# EAGLE design DC28_Jack-Attack_Badge-4 (EAGLE 9.5.2)
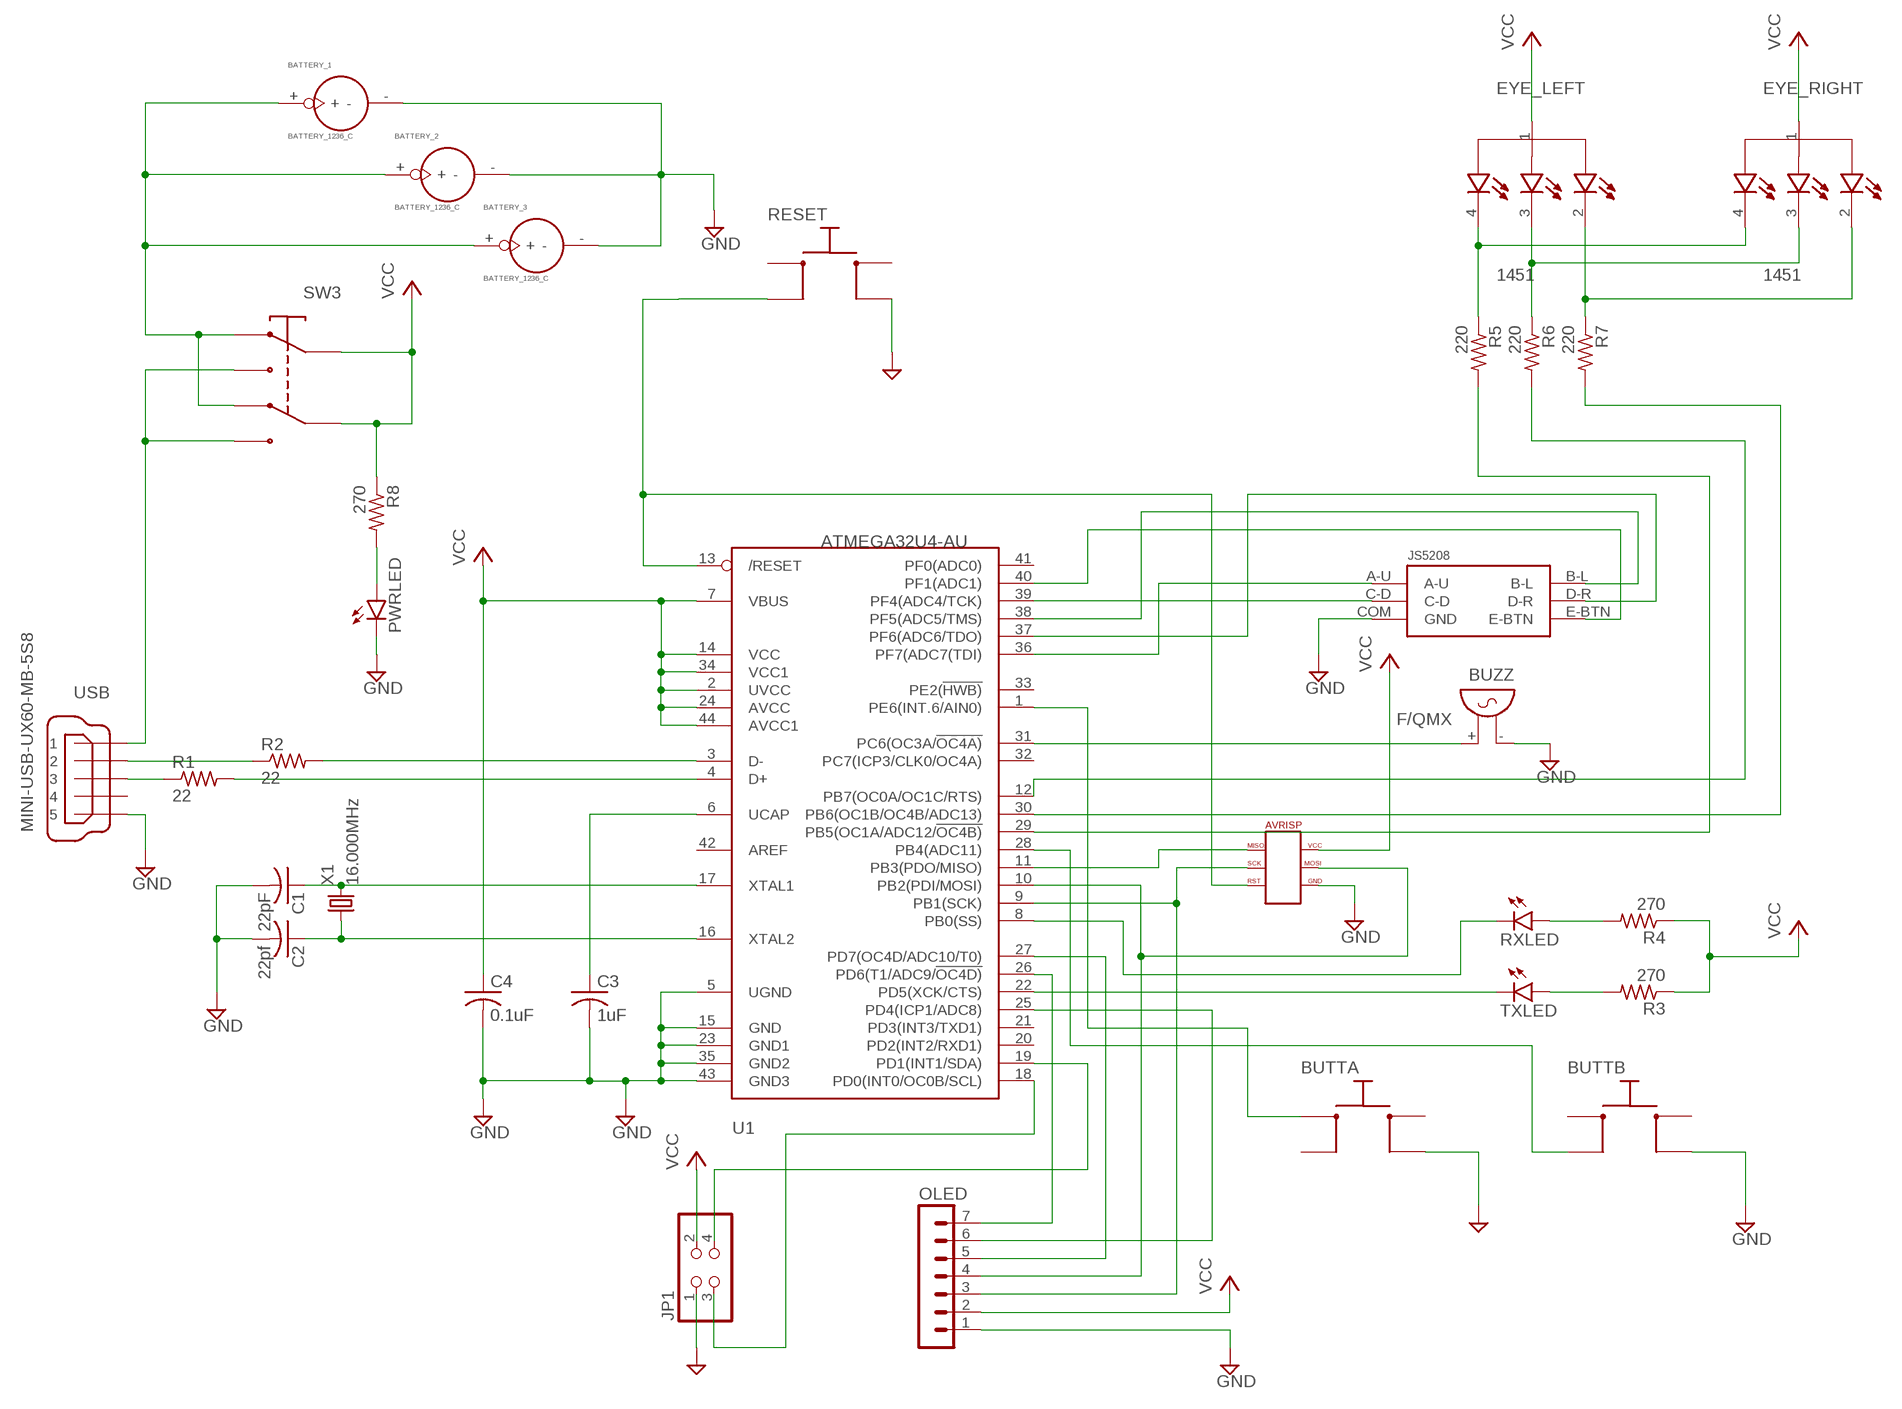
[diagram p0: schematic, sheet 1]

## Parts
BATTERY_1  BATTERY_1236_C  [BATTERY_1236_C]
BATTERY_2  BATTERY_1236_C  [BATTERY_1236_C]
BATTERY_3  BATTERY_1236_C  [BATTERY_1236_C]
BUTTA  PTS645  [PTS645_SMD]
BUTTB  PTS645  [PTS645_SMD]
BUZZ  F/QMX  [F/QMX]
C1  22pF  C-USC0805  [C0805]
C2  22pf  C-USC0805  [C0805]
C3  1uF  C-USC0805  [C0805]
C4  0.1uF  C-USC0805  [C0805]
EYE_LEFT  1451  [LED_1451]
EYE_RIGHT  1451  [LED_1451]
JP1  PINHD-2X2  [2X02]
OLED  MA07-1  [MA07-1]
PWRLED  LEDCHIP-LED0805  [CHIP-LED0805]
R1  22  R-US_R0805  [R0805]
R2  22  R-US_R0805  [R0805]
R3  270  R-US_R0805  [R0805]
R4  270  R-US_R0805  [R0805]
R5  220  R-US_R0805  [R0805]
R6  220  R-US_R0805  [R0805]
R7  220  R-US_R0805  [R0805]
R8  270  R-US_R0805  [R0805]
RESET  PTS645  [PTS645_SMD]
RXLED  LEDCHIP-LED0805  [CHIP-LED0805]
SW3  JS202011AQN  [JS202011AQN]
TXLED  LEDCHIP-LED0805  [CHIP-LED0805]
U1  ATMEGA32U4-AU  [TQFP44]
U$1  AVRISP_POGO  [AVRISP_POGO]
U$2  JS5208  [JS5208_PKG]
USB  MINI-USB-UX60-MB-5S8  [UX60-MB-5S8]
X1  16.000MHz  CSM-7X-DU  [CSM-7X-DU]

## Nets
BATT1: BATTERY_1.+ BATTERY_2.+ BATTERY_3.+ SW3.P$1 SW3.P$4
GND: BATTERY_1.- BATTERY_2.- BATTERY_3.- BUTTA.P$4 BUTTB.P$4 BUZZ.- C1.2 C2.2 C3.2 C4.2 JP1.1 OLED.1 PWRLED.C RESET.P$4 U1.5(UGND) U1.15(GND) U1.23(GND1) U1.35(GND2) U1.43(GND3) U$1.P$6 U$1.P$6B U$2.COM(GND) USB.5
N$1: R1.1 USB.3
N$2: R2.2 U1.3(D-)
N$3: R2.1 USB.2
N$4: R1.2 U1.4(D+)
N$5: C3.1 U1.6(UCAP)
N$6: BUTTA.P$1 U1.1(PE6(INT.6/AIN0))
N$7: C2.1 U1.16(XTAL2) X1.1
N$8: C1.1 U1.17(XTAL1) X1.2
N$9: U1.36(PF7(ADC7(TDI)) U$2.A-U
N$10: U1.11(PB3(PDO/MISO)) U$1.P$1 U$1.P$1B
N$11: OLED.3 U1.9(PB1(SCK)) U$1.P$3 U$1.P$3B
N$12: OLED.4 U1.10(PB2(PDI/MOSI)) U$1.P$4 U$1.P$4B
N$13: U1.37(PF6(ADC6/TDO)) U$2.D-R
N$14: BUTTB.P$2 U1.28(PB4(ADC11))
N$15: RESET.P$2 U1.13(/RESET) U$1.P$5 U$1.P$5B
N$16: BUZZ.+ U1.31(PC6(OC3A/!OC4A))
N$17: TXLED.C U1.22(PD5(XCK/CTS))
N$18: U1.38(PF5(ADC5/TMS)) U$2.B-L
N$19: U1.39(PF4(ADC4/TCK)) U$2.C-D
N$20: R3.2 TXLED.A
N$21: RXLED.C U1.8(PB0(SS))
N$22: R4.2 RXLED.A
N$23: U1.40(PF1(ADC1)) U$2.E-BTN
N$24: PWRLED.A R8.2
N$25: OLED.5 U1.27(PD7(OC4D/ADC10/T0))
N$26: OLED.6 U1.25(PD4(ICP1/ADC8))
N$27: JP1.4 U1.19(PD1(INT1/SDA))
N$28: JP1.3 U1.18(PD0(INT0/OC0B/SCL))
N$29: OLED.7 U1.26(PD6(T1/ADC9/!OC4D))
N$30: R7.2 U1.30(PB6(OC1B/OC4B/ADC13))
N$31: R5.2 U1.29(PB5(OC1A/ADC12/!OC4B))
N$33: EYE_LEFT.4 EYE_RIGHT.4 R5.1
N$34: R6.2 U1.12(PB7(OC0A/OC1C/RTS))
N$36: EYE_LEFT.3 EYE_RIGHT.3 R6.1
N$37: EYE_LEFT.2 EYE_RIGHT.2 R7.1
USB+5V: SW3.P$3 SW3.P$6 USB.1
VCC: C4.1 EYE_LEFT.1 EYE_RIGHT.1 JP1.2 OLED.2 R3.1 R4.1 R8.1 SW3.P$2 SW3.P$5 U1.2(UVCC) U1.7(VBUS) U1.14(VCC) U1.24(AVCC) U1.34(VCC1) U1.44(AVCC1) U$1.P$2 U$1.P$2B
Unconnected: BUTTA.P$2 BUTTA.P$3 BUTTB.P$1 BUTTB.P$3 RESET.P$1 RESET.P$3 U1.20(PD2(INT2/RXD1)) U1.21(PD3(INT3/TXD1)) U1.32(PC7(ICP3/CLK0/OC4A)) U1.33(PE2(!HWB)) U1.41(PF0(ADC0)) U1.42(AREF) USB.4

## Library data of the parts
BATTERY_1-BATTERY_3 = Itead_BP_110825:BATTERY_1236_C: SOC004
BUTTA BUTTB RESET = macetech:PTS645
BUZZ = buzzer:F/QMX: BUZZER Source: Buerklin; OC_FARNELL: unknown; OC_NEWARK: unknown
C1-C4 = rcl:C-US: CAPACITOR, American symbol
EYE_LEFT EYE_RIGHT = 1451:1451: Diffused 'Piranha' Super-flux RGB (tri-color) LED (10 pack); AVAILABILITY: Unavailable; DESCRIPTION: Diffused 'Piranha' Super-flux RGB _tri-color_ LED _10 pack_; MF: Adafruit Industries; MP: 1451; PACKAGE: DIP-4 Adafruit Industries; PRICE: None
JP1 = pinhead:PINHD-2X2: PIN HEADER
OLED = con-lstb:MA07-1: PIN HEADER; OC_FARNELL: unknown; OC_NEWARK: unknown
PWRLED RXLED TXLED = led:LED: LED OSRAM: - CHIPLED LG R971, LG N971, LY N971, LG Q971, LY Q971, LO R971, LY R971 LH N974, LH R974 LS Q976, LO Q976, LY Q976 LO Q996 - Hyper CHIPLED LW Q18S LB Q993, LB Q99A, LB R99A - SideLED LS A670, LO A670, LY A670, LG A670, LP A670 LB A673, LV A673, LT A673, LW A673 LH A674 LY A675 LS A676, LA A676, LO A676, LY A676, LW A676 LS A679, LY A679, LG A679 - Hyper Micro SIDELED® LS Y876, LA Y876, LO Y876, LY Y876 LT Y87S - SmartLED LW L88C, LW L88S LB L89C, LB L89S, LG L890 LS L89K, LO L89K, LY L89K LS L896, LA L896, LO L896, LY L896 - TOPLED LS T670, LO T670, LY T670, LG T670, LP T670 LSG T670, LSP T670, LSY T670, LOP T670, LYG T670 LG T671, LOG T671, LSG T671 LB T673, LV T673, LT T673, LW T673 LH T674 LS T676, LA T676, LO T676, LY T676, LB T676, LH T676, LSB T676, LW T676 LB T67C, LV T67C, LT T67C, LS T67K, LO T67K, LY T67K, LW E67C LS E67B, LA E67B, LO E67B, LY E67B, LB E67C, LV E67C, LT E67C LW T67C LS T679, LY T679, LG T679 LS T770, LO T770, LY T770, LG T770, LP T770 LB T773, LV T773, LT T773, LW T773 LH T774 LS E675, LA E675, LY E675, LS T675 LS T776, LA T776, LO T776, LY T776, LB T776 LHGB T686 LT T68C, LB T68C - Hyper Mini TOPLED® LB M676 - Mini TOPLED Santana® LG M470 LS M47K, LO M47K, LY M47K Source: http://www.osram.convergy.de LUXEON: - LUMILED® LXK2-PW12-R00, LXK2-PW12-S00, LXK2-PW14-U00, LXK2-PW14-V00 LXK2-PM12-R00, LXK2-PM12-S00, LXK2-PM14-U00 LXK2-PE12-Q00, LXK2-PE12-R00, LXK2-PE12-S00, LXK2-PE14-T00, LXK2-PE14-U00 LXK2-PB12-K00, LXK2-PB12-L00, LXK2-PB12-M00, LXK2-PB14-N00, LXK2-PB14-P00, LXK2-PB14-Q00 LXK2-PR12-L00, LXK2-PR12-M00, LXK2-PR14-Q00, LXK2-PR14-R00 LXK2-PD12-Q00, LXK2-PD12-R00, LXK2-PD12-S00 LXK2-PH12-R00, LXK2-PH12-S00 LXK2-PL12-P00, LXK2-PL12-Q00, LXK2-PL12-R00 Source: www.luxeon.com KINGBRIGHT: KA-3528ASYC Source: www.kingbright.com
R1-R8 = rcl:R-US_: RESISTOR, American symbol
SW3 = macetech:JS202011AQN
U1 = adafruit:ATMEGA32U4: http://www.ladyada.net/library/eagle
U$1 = macetech:AVRISP_POGO
U$2 = JS5208:JS5208; AVAILABILITY: Unavailable; DESCRIPTION: JS Series 20 mA Gull Wing Silver Contact Navigation Switch; MF: E-Switch; MP: JS5208; PACKAGE: None; PRICE: None
USB = con-hirose:MINI-USB-: MINI USB Connector Source: http://www.hirose.co.jp/cataloge_hp/e24000019.pdf; OC_FARNELL: unknown; OC_NEWARK: unknown
X1 = crystal:CSM-7X-DU: SMD CRYSTAL Source: www.ecsxtal.com .. Crystal 3.6864MHz CSM_7X_DU.PDF; OC_FARNELL: unknown; OC_NEWARK: unknown

## Board
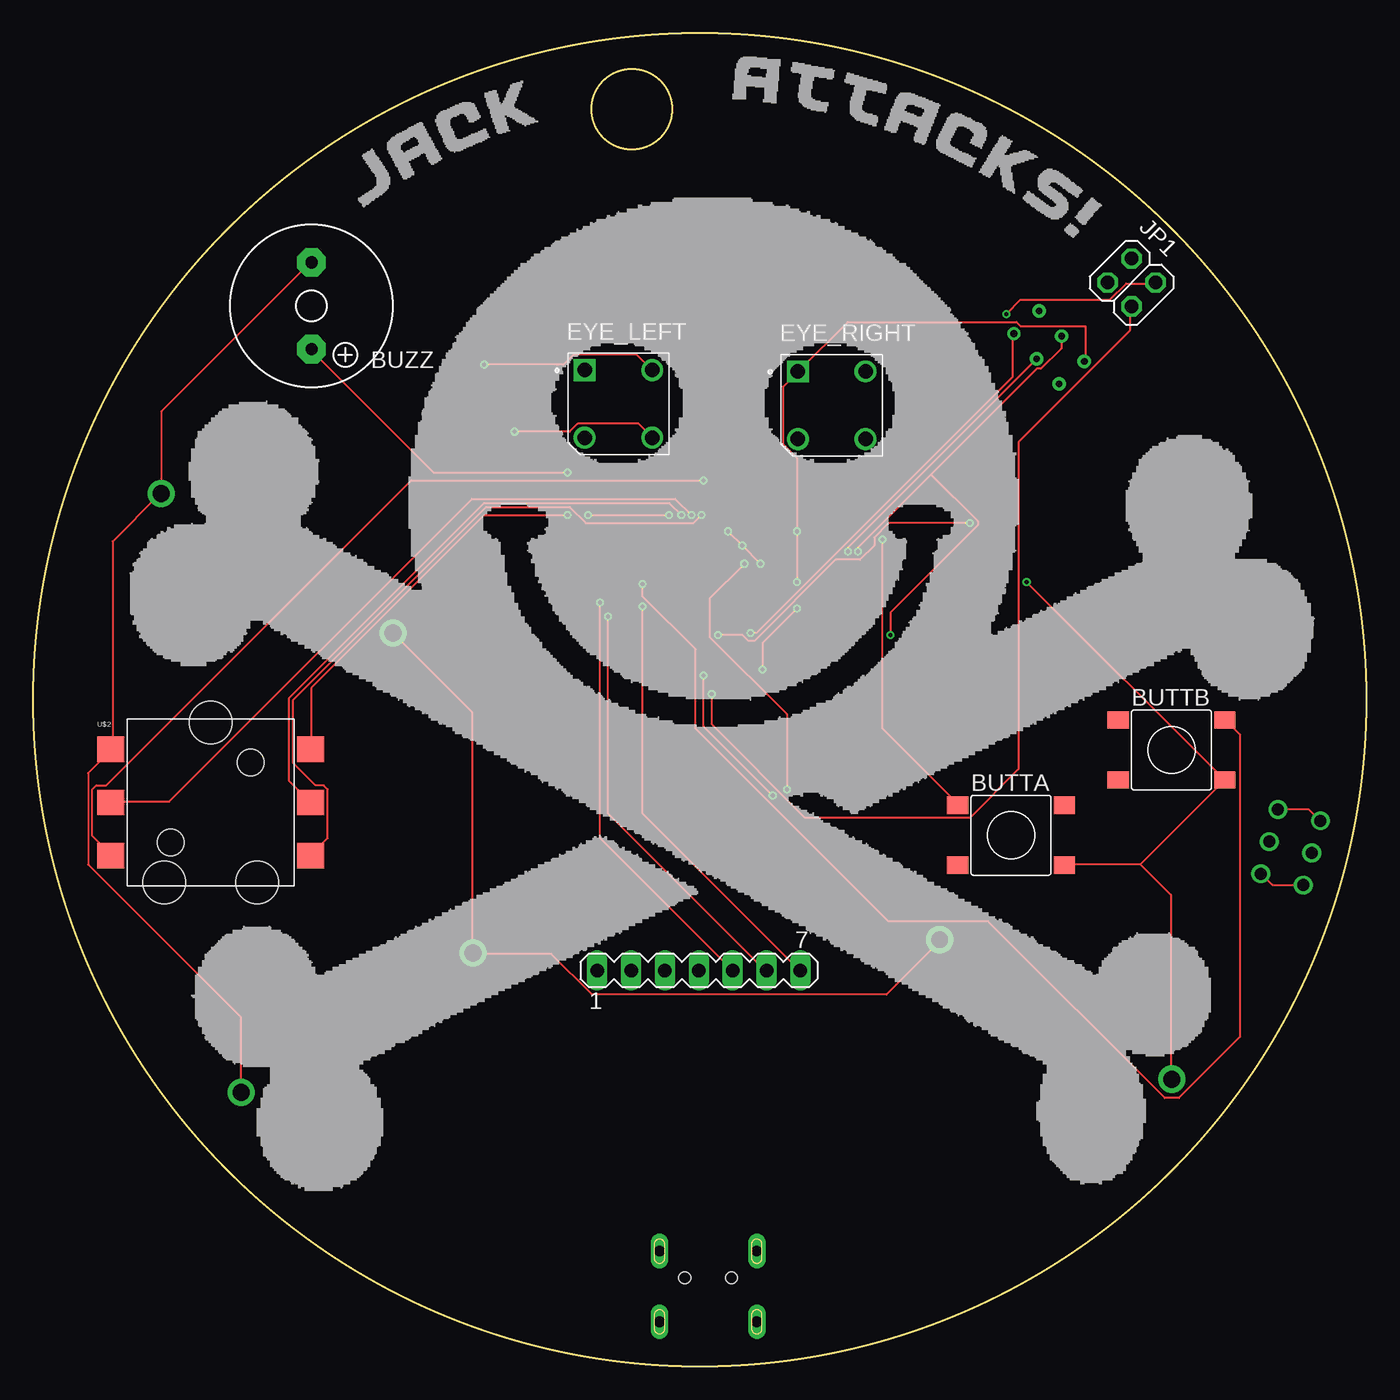
[diagram p1: board, top side]
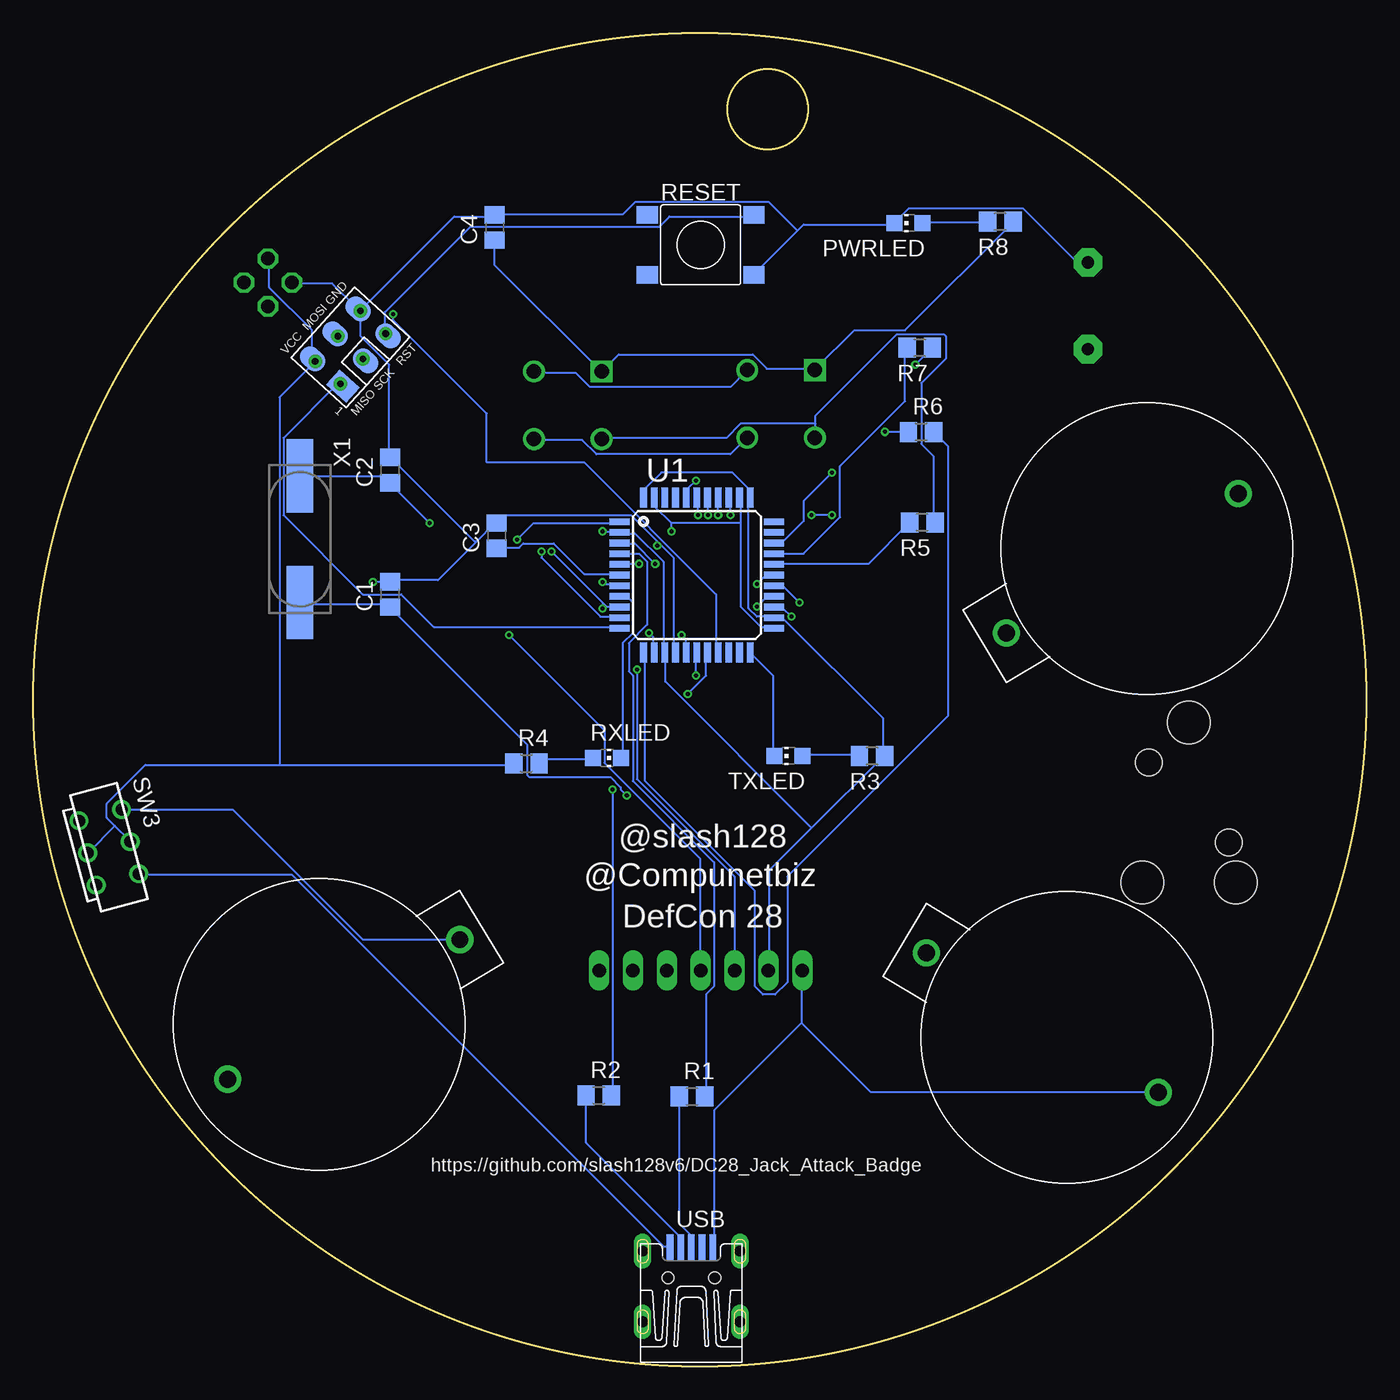
[diagram p2: board, bottom side, seen from below]

Size 100 x 100 mm. Coordinates in mm from the lower left corner, seen from the top.
Outline: circle at 50,50 radius 50
Outline: circle at 44.9,94.3 radius 3
Copper layers (1*16): Top 0.035mm / dielectric 1.5mm / Bottom 0.035mm
Design rules "SeeedStudio_2layer_DRU_no_angle_20140221": minimum track width 6mil, minimum drill 12mil, track to track 6mil, track to pad 6mil, pad to pad 6mil, via to via 6mil, smd to smd 0mil, copper to edge 10mil, drill to drill 10mil, minimum pad ring 10mil, minimum via ring 6mil, stop-mask expansion 2mil, vias tented up to drill 100mil, thermal gap 10mil

### Footprints (pad centres in the part's own frame; a part is rotated, then mirrored left to right if it is on the bottom)
BATTERY_1236_C = drill 1.27 pad 2.032: + 0,0; - 0,20.32
PTS645_SMD = smd 1.6 x 1.3: P$1 -4,2.25; P$2 4,2.25; P$3 -4,-2.25; P$4 4,-2.25
F/QMX = drill 0.914 pad 2.159 octagon: + 3.251,0; - -3.251,0
C0805 = smd 1.3 x 1.5: 1 -0.95,0; 2 0.95,0
LED_1451 = drill 1.09 pad 1.64 square: 1 -2.54,2.54 | drill 1.09 pad 1.64: 2 2.54,2.54; 3 2.54,-2.54; 4 -2.54,-2.54
2X02 = drill 1.016 octagon: 1 -1.27,-1.27; 2 -1.27,1.27; 3 1.27,-1.27; 4 1.27,1.27
MA07-1 = drill 1.016 long: 1 -7.62,0; 2 -5.08,0; 3 -2.54,0; 4 0,0; 5 2.54,0; 6 5.08,0; 7 7.62,0
CHIP-LED0805 = smd 1.2 x 1.2: A 0,-1.05; C 0,1.05
R0805 = smd 1.3 x 1.5: 1 -0.95,0; 2 0.95,0
JS202011AQN = drill 0.9: P$1 -2.5,1.65; P$2 0,1.65; P$3 2.5,1.65; P$4 -2.5,-1.65; P$5 0,-1.65; P$6 2.5,-1.65
TQFP44 = smd 1.5 x 0.5: 1 -5.8,4; 2 -5.8,3.2; 3 -5.8,2.4; 4 -5.8,1.6; 5 -5.8,0.8; 6 -5.8,0; 7 -5.8,-0.8; 8 -5.8,-1.6; 9 -5.8,-2.4; 10 -5.8,-3.2; 11 -5.8,-4; 23 5.8,-4; 24 5.8,-3.2; 25 5.8,-2.4; 26 5.8,-1.6; 27 5.8,-0.8; 28 5.8,0; 29 5.8,0.8; 30 5.8,1.6; 31 5.8,2.4; 32 5.8,3.2; 33 5.8,4 | smd 0.5 x 1.5: 12 -4,-5.8; 13 -3.2,-5.8; 14 -2.4,-5.8; 15 -1.6,-5.8; 16 -0.8,-5.8; 17 0,-5.8; 18 0.8,-5.8; 19 1.6,-5.8; 20 2.4,-5.8; 21 3.2,-5.8; 22 4,-5.8; 34 4,5.8; 35 3.2,5.8; 36 2.4,5.8; 37 1.6,5.8; 38 0.8,5.8; 39 0,5.8; 40 -0.8,5.8; 41 -1.6,5.8; 42 -2.4,5.8; 43 -3.2,5.8; 44 -4,5.8
AVRISP_POGO = smd 2.032 x 1.524: P$1 -1.524,2.54; P$2 1.524,2.54; P$3 -1.524,0; P$4 1.524,0; P$5 -1.524,-2.54; P$6 1.524,-2.54 | drill 0.5: P$1B -1.27,2.54; P$2B 1.27,2.54; P$3B -1.27,0; P$4B 1.27,0; P$5B -1.27,-2.54; P$6B 1.27,-2.54
JS5208_PKG = smd 2 x 1.9: A-U 7.5,4; B-L -7.5,0; C-D 7.5,-4; COM -7.5,4; D-R 7.5,0; E-BTN -7.5,-4 | hole 3.2: -3.5,-6; 3.5,-6; 0,6 | hole 2: -3,-3; 3,3
UX60-MB-5S8 = smd 2 x 0.5: 1 8.65,1.6; 2 8.65,0.8; 3 8.65,0; 4 8.65,-0.8; 5 8.65,-1.6 | drill 0.8 long: M1 3.1,-3.65; M2 3.1,3.65; M3 8.4,3.65; M4 8.4,-3.65 | hole 0.9: 6.4,-1.75; 6.4,1.75
CSM-7X-DU = smd 5.5 x 2: 1 -4.75,0; 2 4.75,0

### Placement (x,y rotation side)
BATTERY_1  68,32 121 bottom
BATTERY_2  33,31 239 bottom
BATTERY_3  27,55 301 bottom
BUTTA  73.35,39.83 0 top
BUTTB  85.39,46.23 0 top
BUZZ  20.87,79.56 270 top
C1  73.23,57.91 90 bottom
C2  73.23,67.23 90 bottom
C3  65.23,62.31 90 bottom
C4  65.39,85.43 90 bottom
EYE_LEFT  43.9,72.2 0 top
EYE_RIGHT  59.9,72.1 0 top
JP1  82.4,81.3 315 top
OLED  49.93,29.69 0 top
PWRLED  34.36,85.77 90 bottom
R1  50.58,20.24 0 bottom
R2  57.58,20.32 0 bottom
R3  37.07,45.77 180 bottom
R4  63.01,45.23 0 bottom
R5  33.3,63.3 180 bottom
R6  33.4,70.1 0 bottom
R7  33.5,76.4 180 bottom
R8  27.45,85.87 180 bottom
RESET  49.93,84.13 0 bottom
RXLED  56.95,45.63 270 bottom
SW3  94.33,38.93 285 bottom
TXLED  43.35,45.8 90 bottom
U1  50.22,59.36 0 bottom
U$1  76.21,76.43 138 bottom
U$2  13.3,42.3 0 top
USB  50.63,0.23 90 bottom
X1  80,62.04 270 bottom

### Tracks (layer width: path | path; a pad name or v marks a point on that pad's centre or on a via)
BATT1
  Top 0.152: BATTERY_3.+ 27.13,54.86 32.92,49.07 32.92,31.09 BATTERY_2.+ 33.07,30.94 38.86,30.94 41.91,27.89 64.01,27.89 67.97,31.85 BATTERY_1.+ | SW3.P$1 93.42,41.76 95.71,41.76 96.47,41 SW3.P$4
  Bottom 0.152: BATTERY_1.+ 68.12,32 75.29,32 85.04,41.76 93.27,41.76 SW3.P$1
GND  (via drill 0.3)
  Top 0.152: 83.06,37.64 77.42,37.64 BUTTA.P$4 | 83.06,37.64 89.31,43.89 BUTTB.P$4 89.31,44.04 v74.52,58.83 | 83.06,37.64 85.34,35.36 85.34,21.64 BATTERY_1.- | v54.56,60.2 v53.19,61.57 v52.12,62.64 | BUZZ.- 20.73,82.75 9.6,71.63 9.6,65.53 BATTERY_3.- 9.45,65.38 5.94,61.87 5.94,46.33 U$2.COM 5.79,46.18 4.12,44.5 4.12,37.64 15.54,26.21 15.54,20.57 BATTERY_2.-
  Bottom 0.152: 46.94,63.25 46.94,65.08 U1.35 | 46.94,63.25 46.94,57 45.41,55.47 44.5,55.47 U1.23 | 52.12,63.25 53.34,64.47 53.34,65.08 U1.43 | 46.94,63.25 52.12,63.25 | 53.03,61.72 55.17,63.86 64.77,63.86 65.23,63.4 C3.2 65.38,63.25 66.75,61.87 | 53.03,61.72 51.97,60.66 51.97,53.65 U1.15 | v54.56,60.2 55.93,60.2 U1.5 | 53.03,61.72 v53.19,61.57 | 66.75,61.87 69.65,58.98 73.15,58.98 C1.2 73.3,58.83 v74.52,58.83 | 66.75,61.87 66.9,61.87 73.15,68.12 C2.2 73.3,68.28 73.3,75.13 75.44,77.27 75.44,79.1 U$1.P$6B | v52.12,62.64 52.12,63.25 | 42.37,25.76 48.92,19.2 48.92,8.99 USB.5 | 42.37,25.76 42.37,29.57 OLED.1 | 42.37,25.76 37.19,20.57 15.7,20.57 BATTERY_2.- | 75.44,79.25 68.43,86.26 65.53,86.26 C4.2 65.38,86.41 55.78,86.41 54.86,87.33 44.81,87.33 42.67,85.19 | 75.44,79.25 U$1.P$6B | 75.44,79.25 U$1.P$6 | 42.67,85.19 45.87,81.99 RESET.P$4 | 42.67,85.19 42.22,85.65 35.51,85.65 PWRLED.C 35.36,85.8 34.29,86.87 25.76,86.87 21.79,82.91 20.88,82.91 BUZZ.- | JP1.1 80.47,81.23 77.57,81.23 75.74,79.4 U$1.P$6B
N$1
  Bottom 0.152: R1.1 51.51,20.12 51.51,10.67 50.75,9.91 50.75,8.99 USB.3
N$2  (via drill 0.3)
  Top 0.152: v56.54,43.28 56.54,48.92 50.75,54.71 50.75,57.61 v53.34,60.2
  Bottom 0.152: v56.54,43.28 56.54,20.42 R2.2 | v53.34,60.2 54.86,61.72 55.93,61.72 U1.3
N$3
  Bottom 0.152: R2.1 58.52,20.27 58.52,16.76 51.51,9.75 51.51,8.99 USB.2
N$4
  Bottom 0.152: U1.4 54.56,60.96 53.95,60.35 53.95,55.63 55.32,54.25 55.32,52.12 55.02,51.82 55.02,43.89 48.92,37.8 48.92,28.5 49.53,27.89 49.53,20.27 R1.2
N$5
  Bottom 0.152: U1.6 56.08,59.44 58.67,59.44 60.96,61.72 63.25,61.72 63.55,61.42 65.23,61.42 C3.1
N$6  (via drill 0.3)
  Top 0.152: v63.7,62.03 63.7,47.85 69.34,42.22 BUTTA.P$1
  Bottom 0.152: v63.7,62.03 62.48,63.25 56.08,63.25 U1.1
N$7  (via drill 0.3)
  Top 0.152: v51.36,54.86 53.19,54.86 53.65,54.41 54.1,54.41 60.2,60.5 62.03,60.5 63.09,61.57 63.09,62.18 64.16,63.25 v70.26,63.25
  Bottom 0.152: v51.36,54.86 51.05,54.56 51.05,53.65 U1.16 | v70.26,63.25 73.15,66.14 C2.1 73.3,66.29 73.76,66.75 79.86,66.75 X1.1
N$8  (via drill 0.3)
  Top 0.152: v50.29,51.82 50.29,48.01 v55.47,42.82
  Bottom 0.152: v50.29,51.82 50.29,53.49 U1.17 | v55.47,42.82 55.93,43.28 55.93,43.43 56.69,44.2 62.79,44.2 62.94,44.35 62.94,46.63 73.15,56.84 C1.1 73.3,57 73.46,57.15 79.86,57.15 X1.2
N$9  (via drill 0.3)
  Top 0.152: v41.6,63.86 v47.7,63.86 | v40.08,63.86 33.83,63.86 20.88,50.9 20.88,46.33 U$2.A-U
  Bottom 0.152: v47.7,63.86 47.7,65.08 U1.36 | v40.08,63.86 v41.6,63.86
N$10
  Bottom 0.152: 77.11,73.76 81.23,69.65 81.23,63.86 75.29,57.91 72.39,57.91 69.95,55.47 56.08,55.47 U1.11 | 77.11,73.76 U$1.P$1B | 77.11,73.76 U$1.P$1
N$11  (via drill 0.3)
  Top 0.152: v61.11,61.11 61.11,61.42 75.13,75.44 U$1.P$3B | v54.71,52.27 54.71,54.25 v57.3,56.84
  Bottom 0.152: v61.11,61.11 57.3,57.3 | 57.3,57.3 57,57 56.08,57 U1.9 | U$1.P$3 75.13,75.44 U$1.P$3B | v54.71,52.27 54.71,44.04 47.4,36.73 47.4,29.72 OLED.3 | 57.3,57.3 v57.3,56.84
N$12  (via drill 0.3)
  Top 0.152: v61.87,61.11 61.87,61.42 67.36,66.9 | 67.36,66.9 75.29,74.83 75.59,74.83 77.11,76.35 77.11,77.27 U$1.P$4B | v64.31,54.86 64.31,56.54 70.87,63.09 70.87,63.4 67.36,66.9
  Bottom 0.152: v61.87,61.11 61.87,60.66 57.45,56.24 56.08,56.24 U1.10 | U$1.P$4 77.27,77.42 U$1.P$4B | v64.31,54.86 57.15,47.7 57.15,45.26 49.99,38.1 49.99,29.72 OLED.4
N$13  (via drill 0.3)
  Top 0.152: v48.62,63.86 47.7,64.77 33.83,64.77 19.2,50.14 19.2,43.89 20.73,42.37 U$2.D-R
  Bottom 0.152: v48.62,63.86 48.62,65.08 U1.37
N$14  (via drill 0.3)
  Top 0.152: v45.72,58.67 45.72,57.76 49.68,53.8 49.68,47.85 64.16,33.38 71.63,33.38 84.89,20.12 85.95,20.12 90.53,24.69 90.53,47.4 89.46,48.46 BUTTB.P$2
  Bottom 0.152: v45.72,58.67 45.11,59.28 44.5,59.28 U1.28
N$15  (via drill 0.3)
  Top 0.152: v53.8,55.02 54.25,55.02 73.46,74.22 73.46,77.42 U$1.P$5B
  Bottom 0.152: v53.8,55.02 53.49,54.71 53.49,53.65 U1.13 | RESET.P$2 46.02,86.26 52.27,86.26 53.03,85.5 67.21,85.5 73.61,79.1 73.61,77.57 U$1.P$5B 73.46,77.42 U$1.P$5
N$16  (via drill 0.3)
  Top 0.152: v40.08,67.06 30.02,67.06 20.88,76.2 BUZZ.+
  Bottom 0.152: v40.08,67.06 42.22,64.92 42.22,63.4 43.74,61.87 44.35,61.87 U1.31
N$17
  Bottom 0.152: TXLED.C 44.5,45.87 44.5,51.82 46.18,53.49 U1.22
N$18  (via drill 0.3)
  Top 0.152: v49.38,63.86 48.16,65.08 32.92,65.08 10.21,42.37 5.94,42.37 U$2.B-L
  Bottom 0.152: v49.38,63.86 49.38,65.08 U1.38
N$19  (via drill 0.3)
  Top 0.152: v50.14,63.86 49.53,63.25 41.45,63.25 40.23,64.47 33.98,64.47 19.51,49.99 19.51,45.26 21.18,43.59 21.79,43.59 22.1,43.28 22.1,39.62 20.88,38.41 U$2.C-D
  Bottom 0.152: v50.14,63.86 50.14,65.08 U1.39
N$20
  Bottom 0.152: TXLED.A 42.22,45.87 38.1,45.87 R3.2
N$21
  Bottom 0.152: RXLED.C 55.78,45.72 55.78,54.25 55.02,55.02 55.02,57.3 55.47,57.76 55.93,57.76 U1.8
N$22
  Bottom 0.152: RXLED.A 58.06,45.57 61.72,45.57 62.03,45.26 R4.2
N$23  (via drill 0.3)
  Top 0.152: v50.29,66.45 28.35,66.45 5.49,43.59 4.72,43.59 4.42,43.28 4.42,39.78 5.79,38.41 U$2.E-BTN
  Bottom 0.152: v50.29,66.45 50.9,65.84 50.9,65.23 U1.40
N$24
  Bottom 0.152: PWRLED.A 33.22,85.8 28.5,85.8 R8.2
N$25  (via drill 0.3)
  Top 0.152: v42.52,57.3 42.52,39.62 52.43,29.72 OLED.5
  Bottom 0.152: v42.52,57.3 43.74,58.52 44.35,58.52 U1.27
N$26  (via drill 0.3)
  Top 0.152: v43.13,56.24 43.13,41.45 54.86,29.72 OLED.6
  Bottom 0.152: v43.13,56.24 43.74,56.84 44.35,56.84 U1.25
N$27  (via drill 0.3)
  Top 0.152: v73,78.94 74.07,80.01 80.77,80.01 81.99,81.23 84.12,81.23 JP1.4
  Bottom 0.152: U1.19 48.77,53.65 48.77,57.91 58.67,67.82 65.99,67.82 65.99,71.48 73,78.49 v73,78.94
N$28  (via drill 0.3)
  Top 0.152: v50.9,50.44 50.9,48.16 57.91,41.15 70.26,41.15 73.91,44.81 73.91,69.34 82.3,77.72 82.3,79.4 JP1.3
  Bottom 0.152: v50.9,50.44 49.53,51.82 49.53,53.49 U1.18
N$29  (via drill 0.3)
  Top 0.152: v45.72,57 45.72,41.45 57.45,29.72 OLED.7
  Bottom 0.152: v45.72,57 44.96,57.76 44.5,57.76 U1.26
N$30
  Bottom 0.152: U1.30 42.22,60.96 39.47,63.7 39.47,67.51 34.59,72.39 34.59,76.35 R7.2
N$31
  Bottom 0.152: U1.29 44.35,60.2 37.34,60.2 34.29,63.25 R5.2
N$33
  Bottom 0.152: 41.3,70.71 41.3,69.8 EYE_LEFT.4 | 41.3,70.71 41.3,71.32 35.2,77.42 31.7,77.42 31.55,77.27 31.55,75.59 33.38,73.76 33.38,69.19 32.46,68.28 32.46,63.4 R5.1 | 41.3,70.71 46.94,70.71 48.01,69.65 57.3,69.65 EYE_RIGHT.4
N$34
  Bottom 0.152: U1.12 54.1,53.49 54.1,43.89 45.87,35.66 45.87,28.5 45.26,27.89 44.35,27.89 43.43,28.8 43.43,36.73 31.39,48.77 31.39,69.04 32.31,69.95 R6.2
N$36  (via drill 0.3)
  Top 0.152: v36.12,70.1 40.23,70.1 40.84,70.71 45.41,70.71 46.33,69.8 EYE_LEFT.3
  Bottom 0.152: v36.12,70.1 34.44,70.1 R6.1 | EYE_RIGHT.3 62.33,69.49 58.83,69.49 57.76,68.43 47.7,68.43 46.48,69.65 EYE_LEFT.3
N$37  (via drill 0.3)
  Top 0.152: v33.83,75.13 39.78,75.13 40.54,75.89 45.26,75.89 46.33,74.83 EYE_LEFT.2
  Bottom 0.152: v33.83,75.13 32.61,76.35 R7.1 | EYE_RIGHT.2 62.33,74.52 59.28,74.52 58.22,73.46 47.7,73.46 46.48,74.68 EYE_LEFT.2
USB+5V
  Top 0.152: SW3.P$6 95.25,36.12 92.96,36.12 92.2,36.88 SW3.P$3
  Bottom 0.152: USB.1 52.27,8.99 52.73,8.99 80.62,36.88 92.05,36.88 SW3.P$3
VCC  (via drill 0.3)
  Top 0.152: U$1.P$2B 78.94,75.44 78.94,78.03 74.07,78.03 73.76,78.33 61.11,78.33 57.45,74.68 EYE_RIGHT.1 57.3,74.52 56.24,73.46 56.24,69.19 57.3,68.12 v57.3,62.64 v57.3,58.83
  Bottom 0.152: U1.44 54.1,65.23 54.1,65.84 52.88,67.06 47.55,67.06 46.33,65.84 46.33,65.23 U1.34 46.33,65.08 46.33,56.84 45.72,56.24 44.5,56.24 U1.24 44.35,56.08 43.74,56.08 36.27,48.62 36.27,45.87 R3.1 36.27,45.72 41.6,40.39 | 41.6,40.39 44.81,37.19 44.81,29.72 OLED.2 | 41.6,40.39 52.58,51.36 52.58,53.49 U1.14 52.73,53.65 52.73,60.35 54.86,62.48 55.93,62.48 U1.2 56.08,62.64 v57.3,62.64 | 81.53,45.11 91.59,45.11 94.49,42.22 94.49,41.15 93.88,40.54 | 81.53,45.11 64.01,45.11 R4.1 | 93.88,40.54 92.81,39.47 SW3.P$2 | 93.88,40.54 95.86,38.56 SW3.P$5 | R8.1 26.52,85.8 34.59,77.72 38.41,77.72 41.3,74.83 EYE_LEFT.1 41.45,74.83 44.96,74.83 46.02,75.89 56.08,75.89 57.3,74.68 EYE_RIGHT.1 57.45,74.68 65.38,82.6 65.38,84.43 C4.1 | U$1.P$2B 78.94,75.44 U$1.P$2 | v57.3,58.83 57.15,58.67 56.08,58.67 U1.7 | 81.53,45.11 81.53,72.69 78.94,75.29 U$1.P$2B | JP1.2 82.3,83.06 82.3,80.92 79.1,77.72 79.1,75.59 U$1.P$2B

### Text on the board
bPlace: @slash128 | @Compunetbiz | DefCon 28 | https://github.com/slash128v6/DC28_Jack_Attack_Badge